# EasyEDA schematic 1-Schematic_PIC18F Breakout.json
TITLE: PIC18 Gamer Board; REV: 1.0; Date: 2022-06-12; Sheet: 1/1; Drawn By: Samuel Raumin; Company: your mom
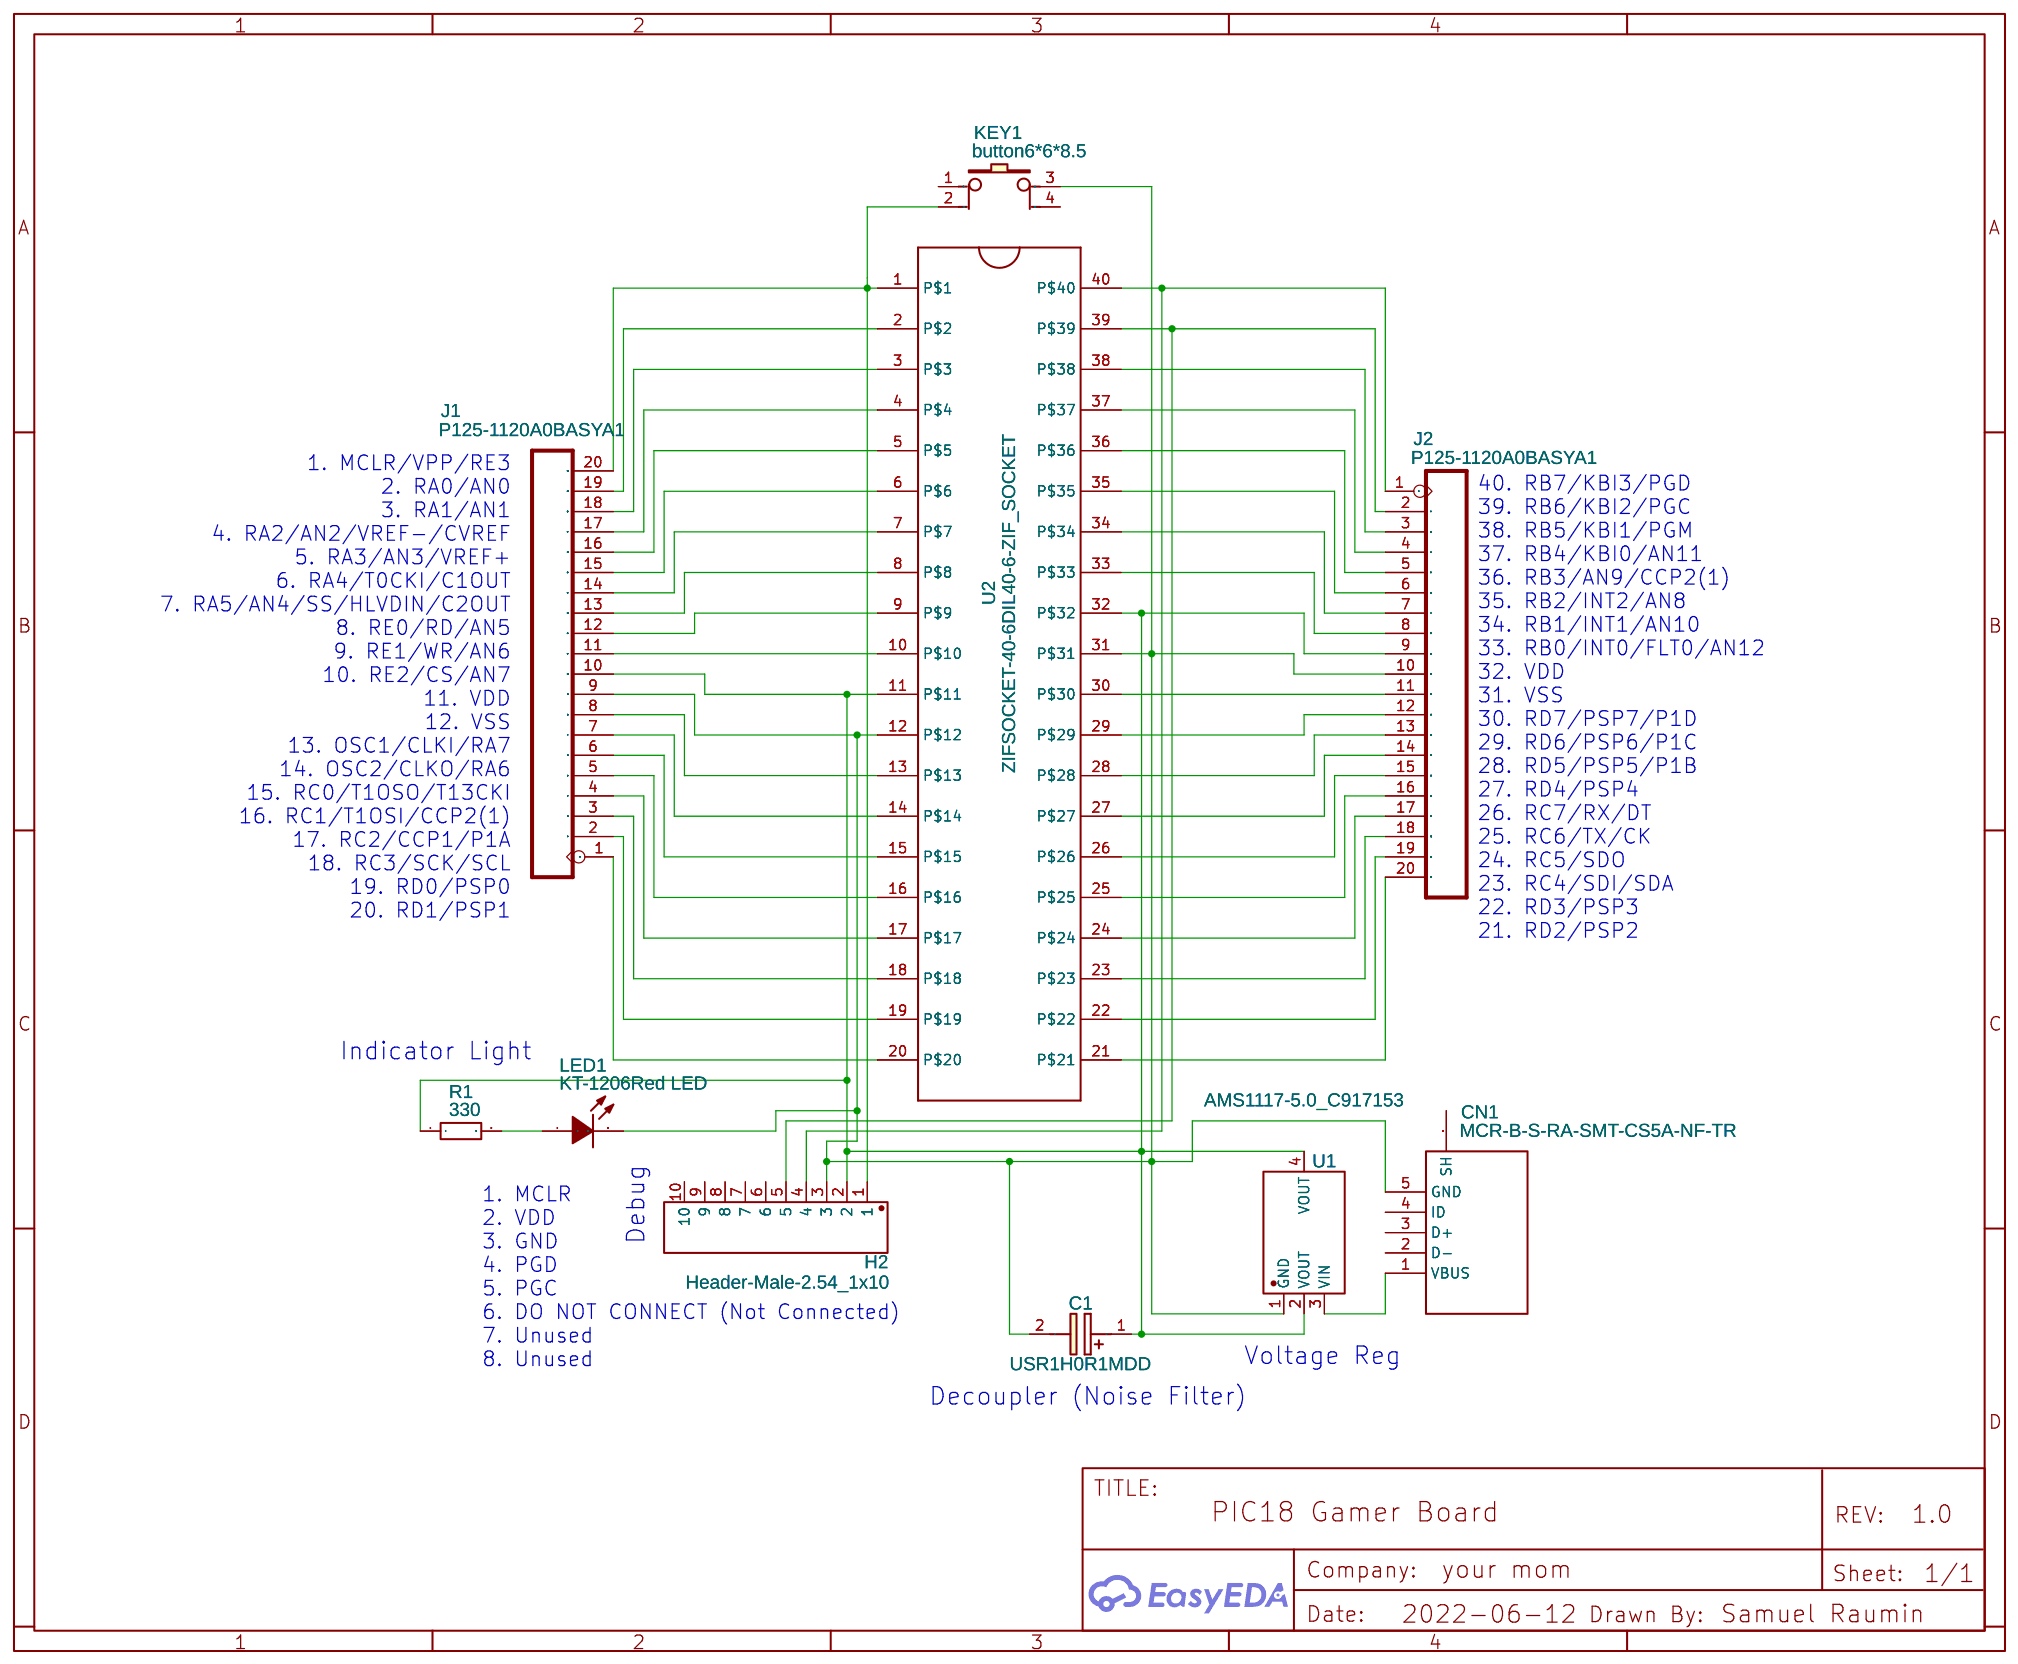
[diagram p0: schematic sheet]

## Parts
C1  USR1H0R1MDD  [USR(4X7)]
CN1  MCR-B-S-RA-SMT-CS5A-NF-TR  [MCR-B-S-RA-SMT-CS5A-NF-TR]
H2  Header-Male-2.54_1x10  [HDR-TH_10P-P2.54-V-M-1]
J1  P125-1120A0BASYA1  [H20-2.54]
J2  P125-1120A0BASYA1  [H20-2.54]
KEY1  button6*6*8.5  [KEY-TH_4P-L6.0-W6.0-P4.50]
LED1  KT-1206Red LED  [LED1206-R-RD]
R1  330  [R1206]
U1  AMS1117-5.0_C917153  [SOT-223-3_L6.7-W3.7-P2.30-LS7.0-BR]
U2  ZIFSOCKET-40-6DIL40-6-ZIF_SOCKET  [DIL40-6-ZIF_SOCKET]

## Library data of the parts
C1 = USR1H0R1MDD: Contributor: MatthieuP
CN1 = MCR-B-S-RA-SMT-CS5A-NF-TR: Supplier Part: 2057-MCR-B-S-RA-SMT-CS5A-NF-T/R-ND; Supplier: Digi-Key; Manufacturer: Adam Tech; Manufacturer Part: MCR-B-S-RA-SMT-CS5A-NF-T/R; Contributor: Keefe Johnson
H2 = Header-Male-2.54_1x10: Supplier: LCSC; Manufacturer Part: Headers  Pins2.54mm1*10P; Supplier Part: C57369; JLCPCB Part Class: Extended Part
J1 J2 = P125-1120A0BASYA1: DIP White Male Header VERT;
KEY1 = button6*6*8.5: Supplier Part: C59980; Supplier: LCSC; Manufacturer: ReliaPro
LED1 = KT-1206Red LED: Supplier: LCSC; Manufacturer: KENTO; Supplier Part: C49018; JLCPCB Part Class: Extended Part
R1 = AECR1206F5R10T9: Supplier: LCSC; Supplier Part: C352052; Manufacturer: ResistorToday; Resistance (Ohms): 5.1; Contributor: LCSC; JLCPCB Part Class: Extended Part
U1 = AMS1117-5.0_C917153: Supplier: LCSC; Supplier Part: C917153; Manufacturer: JSMSEMI; Manufacturer Part: AMS1117-5.0; Contributor: LCSC; JLCPCB Part Class: Extended Part
U2 = ZIFSOCKET-40-6DIL40-6-ZIF_SOCKET: Lever-action ZIF socket for 40-pin ICs; Contributor: SparkFun

## Nets
Net-(C1-1): C1.1(+) H2.2 J1.10 J2.9 R1.1 U1.2(VOUT) U1.4(VOUT) U2.11(P$11) U2.32(P$32)
Net-(C1-2): C1.2(-) CN1.5(GND) H2.3 J1.9 J2.10 KEY1.3 LED1.2(K) U1.1(GND) U2.12(P$12) U2.31(P$31)
Net-(CN1-1): CN1.1(VBUS) U1.3(VIN)
Net-(H2-1): H2.1 J1.20 KEY1.2 U2.1(P$1)
Net-(H2-4): H2.4 J2.1 U2.40(P$40)
Net-(H2-5): H2.5 J2.2 U2.39(P$39)
Net-(J1-1): J1.1 U2.20(P$20)
Net-(J1-2): J1.2 U2.19(P$19)
Net-(J1-3): J1.3 U2.18(P$18)
Net-(J1-4): J1.4 U2.17(P$17)
Net-(J1-5): J1.5 U2.16(P$16)
Net-(J1-6): J1.6 U2.15(P$15)
Net-(J1-7): J1.7 U2.14(P$14)
Net-(J1-8): J1.8 U2.13(P$13)
Net-(J1-11): J1.11 U2.10(P$10)
Net-(J1-12): J1.12 U2.9(P$9)
Net-(J1-13): J1.13 U2.8(P$8)
Net-(J1-14): J1.14 U2.7(P$7)
Net-(J1-15): J1.15 U2.6(P$6)
Net-(J1-16): J1.16 U2.5(P$5)
Net-(J1-17): J1.17 U2.4(P$4)
Net-(J1-18): J1.18 U2.3(P$3)
Net-(J1-19): J1.19 U2.2(P$2)
Net-(J2-3): J2.3 U2.38(P$38)
Net-(J2-4): J2.4 U2.37(P$37)
Net-(J2-5): J2.5 U2.36(P$36)
Net-(J2-6): J2.6 U2.35(P$35)
Net-(J2-7): J2.7 U2.34(P$34)
Net-(J2-8): J2.8 U2.33(P$33)
Net-(J2-11): J2.11 U2.30(P$30)
Net-(J2-12): J2.12 U2.29(P$29)
Net-(J2-13): J2.13 U2.28(P$28)
Net-(J2-14): J2.14 U2.27(P$27)
Net-(J2-15): J2.15 U2.26(P$26)
Net-(J2-16): J2.16 U2.25(P$25)
Net-(J2-17): J2.17 U2.24(P$24)
Net-(J2-18): J2.18 U2.23(P$23)
Net-(J2-19): J2.19 U2.22(P$22)
Net-(J2-20): J2.20 U2.21(P$21)
Net-(LED1-1): LED1.1(A) R1.2

Not connected (* = marked no-connect by the designer): CN1 0(SH) 2(D-) 3(D+) 4(ID); H2 6 7 8 9 10; KEY1 1 4

## Notes on the sheet
- 1. MCLR/VPP/RE3
  2. RA0/AN0
  3. RA1/AN1
  4. RA2/AN2/VREF-/CVREF
  5. RA3/AN3/VREF+
  6. RA4/T0CKI/C1OUT
  7. RA5/AN4/SS/HLVDIN/C2OUT
  8. RE0/RD/AN5
  9. RE1/WR/AN6
  10. RE2/CS/AN7
  11. VDD
  12. VSS
  13. OSC1/CLKI/RA7
  14. OSC2/CLKO/RA6
  15. RC0/T1OSO/T13CKI
  16. RC1/T1OSI/CCP2(1)
  17. RC2/CCP1/P1A
  18. RC3/SCK/SCL
  19. RD0/PSP0
  20. RD1/PSP1
- 40. RB7/KBI3/PGD
  39. RB6/KBI2/PGC
  38. RB5/KBI1/PGM
  37. RB4/KBI0/AN11
  36. RB3/AN9/CCP2(1)
  35. RB2/INT2/AN8
  34. RB1/INT1/AN10
  33. RB0/INT0/FLT0/AN12
  32. VDD
  31. VSS
  30. RD7/PSP7/P1D
  29. RD6/PSP6/P1C
  28. RD5/PSP5/P1B
  27. RD4/PSP4
  26. RC7/RX/DT
  25. RC6/TX/CK
  24. RC5/SDO
  23. RC4/SDI/SDA
  22. RD3/PSP3
  21. RD2/PSP2
- Indicator Light
- 1. MCLR
  2. VDD
  3. GND
  4. PGD
  5. PGC
  6. DO NOT CONNECT (Not Connected)
  7. Unused
  8. Unused
- Debug
- Voltage Reg
- Decoupler (Noise Filter)
